# Altium schematic sheet NeuroMIX.SchDoc
size A; SheetNumber: 1; SheetTotal: 1
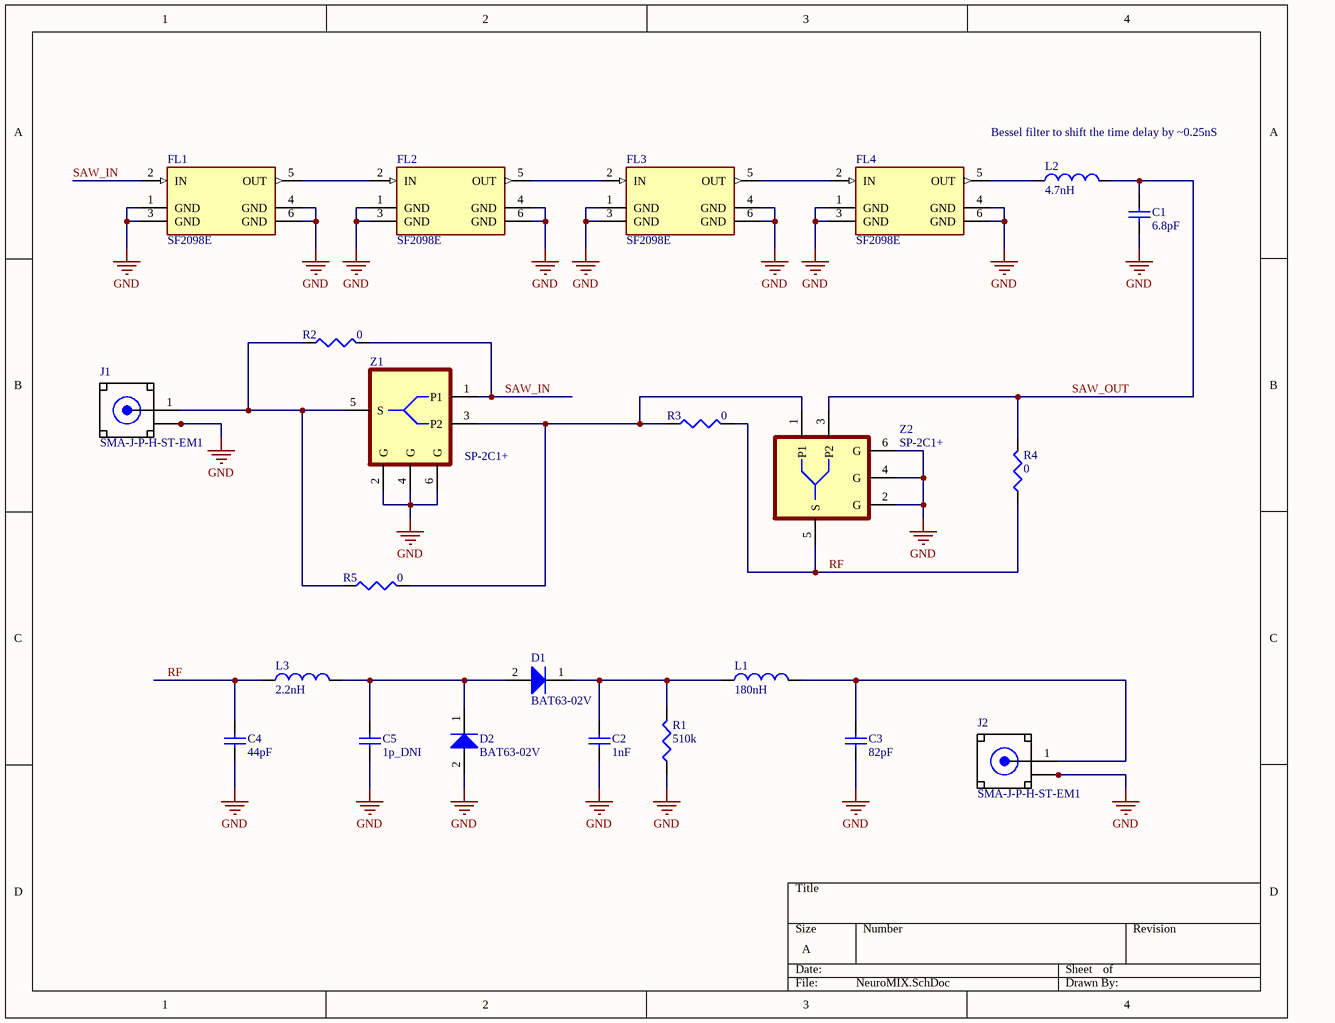
[diagram p0: NeuroMIX.SchDoc]

## Parts
C1  6.8pF  [SMD-0603]
C2  1nF  [SMD-0603]
C3  82pF  [SMD-0603]
C4  44pF  [SMD-0603]
C5  1p_DNI  [SMD-0603]
D1  BAT63-02V  [INF-SC79_V]
D2  BAT63-02V  [INF-SC79_V]
FL1  SF2098E  [FIL_SF2098E]
FL2  SF2098E  [FIL_SF2098E]
FL3  SF2098E  [FIL_SF2098E]
FL4  SF2098E  [FIL_SF2098E]
J1  SMA-J-P-H-ST-EM1  [SMA-J-P-H-ST-EM1]
J2  SMA-J-P-H-ST-EM1  [SMA-J-P-H-ST-EM1]
L1  180nH  [SMD-0603]
L2  4.7nH  [SMD-0603]
L3  2.2nH  [SMD-0603]
R1  510k  [SMD-0603]
R2  0  [SMD-0603]
R3  0  [SMD-0603]
R4  0  [SMD-0603]
R5  0  [SMD-0603]
Z1  SP-2C1+  [SP-2C1+]
Z2  SP-2C1+  [SP-2C1+]

## Nets
GND: C1.1 C2.1 C3.1 C4.1 C5.1 D2.2(A) FL1.1(GND) FL1.3(GND) FL1.4(GND) FL1.6(GND) FL2.1(GND) FL2.3(GND) FL2.4(GND) FL2.6(GND) FL3.1(GND) FL3.3(GND) FL3.4(GND) FL3.6(GND) FL4.1(GND) FL4.3(GND) FL4.4(GND) FL4.6(GND) J1.2_1(GND) J1.2_2(GND) J1.3_1(GND) J1.3_2(GND) J2.2_1(GND) J2.2_2(GND) J2.3_1(GND) J2.3_2(GND) R1.1 Z1.2(G) Z1.4(G) Z1.6(G) Z2.2(G) Z2.4(G) Z2.6(G)
RF: C4.2 L3.1 R3.2 R4.1 Z2.5(S)
SAW_IN: FL1.2(IN) R2.2 Z1.1(P1)
SAW_OUT: C1.2 L2.2 R4.2 Z2.3(P2)
NetC2_2: C2.2 D1.1(K) L1.1 R1.2
NetC3_2: C3.2 J2.1(SIGNAL) L1.2
NetC5_2: C5.2 D1.2(A) D2.1(K) L3.2
NetFL1_5: FL1.5(OUT) FL2.2(IN)
NetFL2_5: FL2.5(OUT) FL3.2(IN)
NetFL3_5: FL3.5(OUT) FL4.2(IN)
NetFL4_5: FL4.5(OUT) L2.1
NetJ1_1: J1.1(SIGNAL) R2.1 R5.1 Z1.5(S)
NetR3_1: R3.1 R5.2 Z1.3(P2) Z2.1(P1)

## Notes on the sheet
- Bessel filter to shift the time delay by ~0.25nS

## Library data of the parts
C1-C5 = CAP0603: Ceramic Capacitor 0603
D1 D2 = BAT63-02V: Single Silicon Schottky Diode, 100 mA IF Max, SC79, Green; Manufacturer: Infineon; CT (typ): 0.65 pF; Green: yes; Group: RF Signal Detection + Power Leveling; IF (max): 100 mA; VF (typ): 0.19 V; VR (max): 3 V; DatasheetVersion: Jun-2011; PackageReference: SC79; PackageDescription: 2-Pin Semiconductor Package, 0.8 x 1.2 mm Body; Configuration: Single; Halogen-free: yes; Mounting Technology: Surface Mount; PartNumber: BAT63-02V; ComponentLink1Description: Manufacturer URL; ComponentLink1URL: http://www.infineon.com/; ComponentLink2Description: Datasheet; ComponentLink2URL: http://www.infineon.com/dgdl/bat63series.pdf?folderId=db3a304314dca389011518104e5d0df2&fileId=db3a304314dca38901151817843c0df4&location=en.Products.RF.RF_Mixer___Detector_Schottky_Diodes.DATASHEET.bat63series.pdf; ComponentLink3Description: Package Specification; ComponentLink3URL: http://www.infineon.com/dgdl/SC79-Package_Overview.pdf?folderId=db3a30431936bc4b011951fbddb03b15&fileId=db3a30431936bc4b01195226fe583b41
FL1-FL4 = SF2098E: 915MHz Frequency Wireless RF SAW Filter (Sound Acoustic Wave) 1.9dB 26MHz Bandwidth 6-SMD, No Lead; MF: Murata Electronics; Mouser-Purchase-URL: https://snapeda.com/shop?store=Mouser&id=2722455; Price: None; SnapEDA_Link: https://www.snapeda.com/parts/SF2098E/Murata%20Electronics%20North%20America/view-part/2722455/?ref=snap; Arrow_Electronics-Purchase-URL: https://snapeda.com/shop?store=Arrow+Electronics&id=2722455; DigiKey-Purchase-URL: https://snapeda.com/shop?store=DigiKey&id=2722455; MP: SF2098E; Value: *; Availability: Good; Package: SMD-6 Murata
J1 J2 = SMA-J-P-H-ST-EM1: Connector SMA F 50Ohm Solder ST Edge Mount Gold Over Nickel Tray; MF: Samtec; Price: None; SnapEDA_Link: https://www.snapeda.com/parts/SMA-J-P-H-ST-EM1/Samtec%20Inc./view-part/?ref=snap; MP: SMA-J-P-H-ST-EM1; Package: None; Availability: Unavailable; Value: *
L1-L3 = L0603: Inductor 0603
R1-R5 = RES0603: Resistor-0603
Z1 Z2 = SP-2C1+: Power Divider, 2 Way-0 , 640 to 1100MHz, 50 ohms, SMT; MF: Mini-Circuits; MP: SBTC-2-10L+; Value: *; Price: None; Package: None; Check_prices: https://www.snapeda.com/parts/SBTC-2-10L+/Mini-Circuits/view-part/564803/?ref=eda; Availability: Warning; Purchase-URL: https://pricing.snapeda.com/search/part/SBTC-2-10L+/?ref=eda; SnapEDA_Link: https://www.snapeda.com/parts/SBTC-2-10L+/Mini-Circuits/view-part/564803/?ref=snap